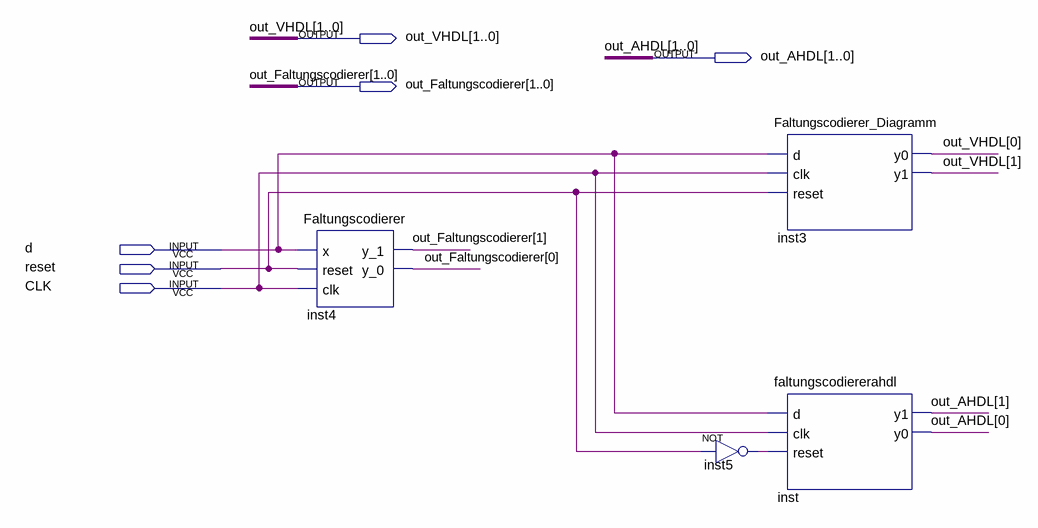
[diagram p0: schematic sheet]
// Quartus schematic Vergleich_Faltungscodierer.bdf as structural Verilog: 4 symbols, 6 pins
module Vergleich_Faltungscodierer (
  input  d,
  input  reset,
  input  CLK,
  output [1:0] out_VHDL,
  output [1:0] out_AHDL,
  output [1:0] out_Faltungscodierer
);

  wire inst5_out;

  Faltungscodierer inst4 (
    .x(d), .reset(reset), .clk(CLK), .y_1(out_Faltungscodierer[1]), .y_0(out_Faltungscodierer[0]));
  not inst5 (inst5_out, reset);
  Faltungscodierer_Diagramm inst3 (.d(d), .clk(CLK), .reset(reset), .y0(out_VHDL[0]), .y1(out_VHDL[1]));
  faltungscodiererahdl inst (.d(d), .clk(CLK), .reset(inst5_out), .y1(out_AHDL[1]), .y0(out_AHDL[0]));
endmodule
